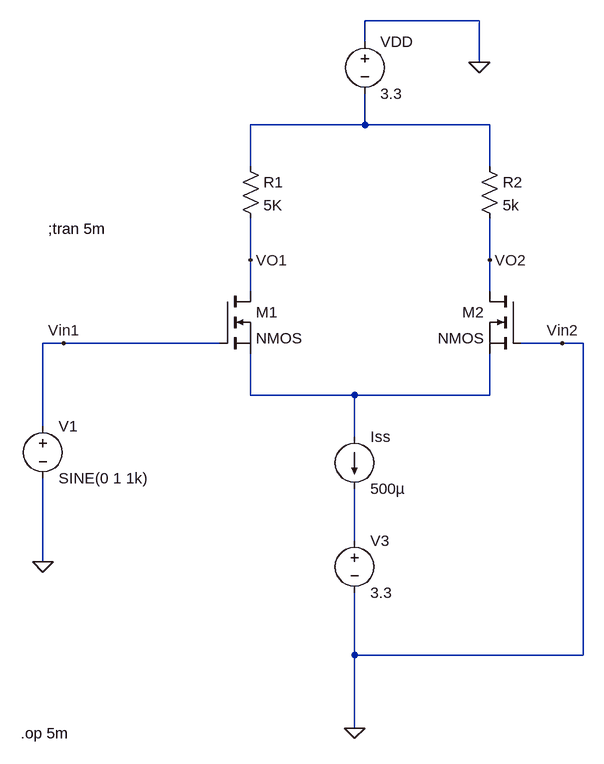
[diagram p0: schematic differential pair.asc]
differential pair.asc, the LTspice schematic file:
Version 4
SHEET 1 880 1108
WIRE 416 -112 240 -112
WIRE 240 -80 240 -112
WIRE 416 -48 416 -112
WIRE 240 48 240 0
WIRE 240 48 64 48
WIRE 432 48 240 48
WIRE 64 112 64 48
WIRE 432 112 432 48
WIRE 64 256 64 192
WIRE 432 256 432 192
WIRE 64 304 64 256
WIRE 432 304 432 256
WIRE -224 384 -256 384
WIRE 16 384 -224 384
WIRE 544 384 480 384
WIRE 576 384 544 384
WIRE 64 464 64 400
WIRE 224 464 64 464
WIRE 432 464 432 400
WIRE 432 464 224 464
WIRE -256 512 -256 384
WIRE 224 528 224 464
WIRE 224 688 224 608
WIRE -256 720 -256 592
WIRE 224 864 224 768
WIRE 576 864 576 384
WIRE 576 864 224 864
WIRE 224 976 224 864
FLAG -256 720 0
FLAG 224 976 0
FLAG 64 256 VO1
FLAG 432 256 VO2
FLAG -224 384 Vin1
FLAG 544 384 Vin2
FLAG 416 -48 0
SYMBOL res 48 96 R0
SYMATTR InstName R1
SYMATTR Value 5K
SYMBOL res 416 96 R0
SYMATTR InstName R2
SYMATTR Value 5k
SYMBOL nmos 16 304 R0
SYMATTR InstName M1
SYMBOL nmos 480 304 M0
SYMATTR InstName M2
SYMBOL voltage -256 496 R0
WINDOW 123 0 0 Left 0
WINDOW 39 0 0 Left 0
SYMATTR InstName V1
SYMATTR Value SINE(0 1 1k)
SYMBOL voltage 240 -96 R0
WINDOW 123 0 0 Left 0
WINDOW 39 0 0 Left 0
SYMATTR InstName VDD
SYMATTR Value 3.3
SYMBOL voltage 224 672 R0
WINDOW 123 0 0 Left 0
WINDOW 39 0 0 Left 0
SYMATTR InstName V3
SYMATTR Value 3.3
SYMBOL current 224 528 R0
WINDOW 123 0 0 Left 0
WINDOW 39 0 0 Left 0
SYMATTR InstName Iss
SYMATTR Value 500µ
TEXT -290 984 Left 2 !.op 5m
TEXT -248 208 Left 2 !;tran 5m

The netlist it stands for:
* differential pair.asc
R1 N001 VO1 5K
R2 N001 VO2 5k
M1 VO1 Vin1 N002 N002 NMOS
M2 VO2 0 N002 N002 NMOS
V1 Vin1 0 SINE(0 1 1k)
VDD 0 N001 3.3
V3 N003 0 3.3
Iss N002 N003 500µ
.model NMOS NMOS
.model PMOS PMOS
.lib standard.mos
.op 5m
;tran 5m
.backanno
.end